# Altium project Interface Board V0.PrjPcb
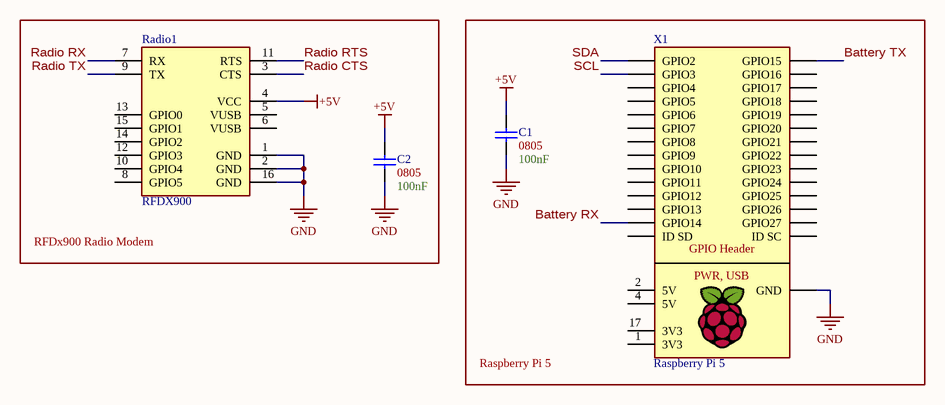
[diagram p0: Raspberry Pi and RF Devices.SchDoc]
5 sheets, 66 parts. Net scope: global (net labels, ports and power ports of the same name join across sheets).
Board file: main.PcbDoc
Sheets:
  Raspberry Pi and RF Devices.SchDoc
  Power.SchDoc
  CubePilot and Motor Drivers.SchDoc
  I2C Connections.SchDoc
  Misc.SchDoc

## Sheet Raspberry Pi and RF Devices.SchDoc
size B; SheetNumber: 1; SheetTotal: 5

### Parts
(Parts that share a designator on the sheet are numbered #1, #2 ... from top to bottom, then left to right.)
C1#1  Size Package: 0805  Capacitance: 100nF  [[Cap] SMD 0805]  (hidden comment: SMD Nonpolarized)
C2#1  Size Package: 0805  Capacitance: 100nF  [[Cap] SMD 0805]  (hidden comment: SMD Nonpolarized)
Radio1  RFDX900  [[Device] RFDX900 Radio]
X1  Raspberry Pi 5  [[Device] Raspberry Pi 5]

### Blocks framed on the sheet
RFDx900 Radio Modem: C2#1 Radio1
Raspberry Pi 5: C1#1 X1

### Nets
+5V: C1#1.1 C2#1.1 Radio1.4(VCC)
GND: C1#1.2 C2#1.2 Radio1.1(GND) Radio1.2(GND) Radio1.16(GND) X1.GND
Battery RX: X1.8(GPIO14)
Battery TX: X1.10(GPIO15)
Radio CTS: Radio1.3(CTS)
Radio RTS: Radio1.11(RTS)
Radio RX: Radio1.7(RX)
Radio TX: Radio1.9(TX)
SCL: X1.5(GPIO3)
SDA: X1.3(GPIO2)

Not connected (* = marked no-connect by the designer): Radio1 5(VUSB) 6(VUSB) 8(GPIO5) 10(GPIO4) 12(GPIO3) 13(GPIO0) 14(GPIO2) 15(GPIO1); X1 1(3V3) 2(5V) 4(5V) 7(GPIO4) 11(GPIO17) 12(GPIO18) 13(GPIO27) 15(GPIO22) 16(GPIO23) 17(3V3) 18(GPIO24) 19(GPIO10) 21(GPIO9) 22(GPIO25) 23(GPIO11) 24(GPIO7) 26(GPIO8) 27(ID_SD) 28(ID_SC) 29(GPIO5) 31(GPIO6) 32(GPIO12) 33(GPIO13) 35(GPIO19) 36(GPIO16) 37(GPIO26) 38(GPIO20) 40(GPIO21)

### Notes on the sheet
- (in symbol [Device] Raspberry Pi 5) GPIO Header; PWR, USB

### Library data of the parts
C1#1 C2#1 = [Cap] SMD Nonpolarized
Radio1 = [Device] RFDX900 Radio: RFDX900 Long-Range RF Module
X1 = [Device] Raspberry Pi 5

## Sheet Power.SchDoc
size A; SheetNumber: 2; SheetTotal: 5
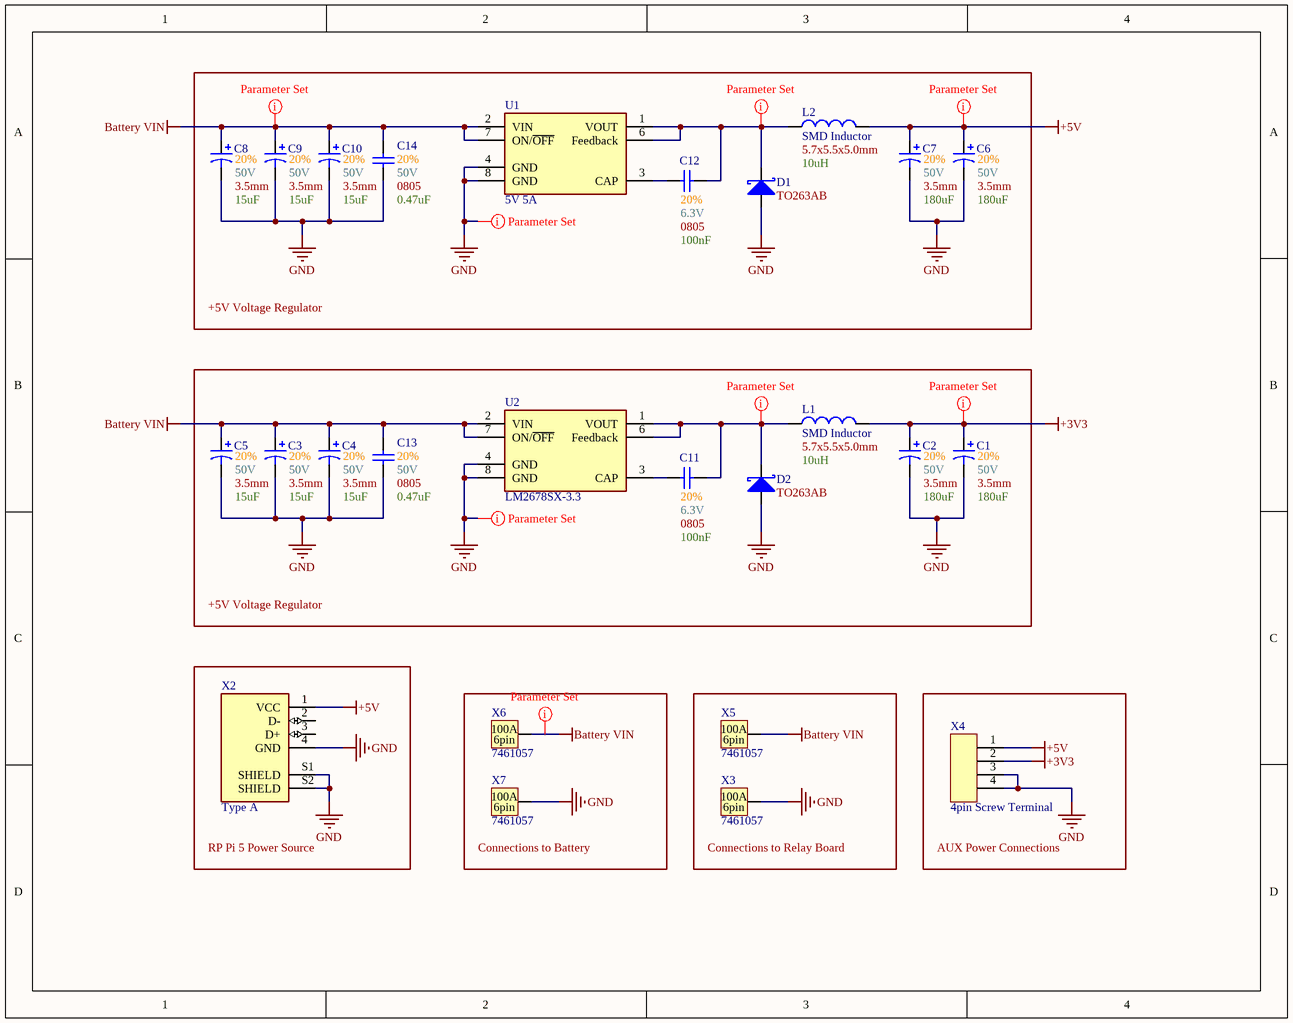
[diagram p1: Power.SchDoc]

### Parts
(Parts that share a designator on the sheet are numbered #1, #2 ... from top to bottom, then left to right.)
C1#2  Tolerance: 20%  Voltage: 50V  Pin Spacing: 3.5mm  Capacitance: 180uF  [[Cap] Thru-Hole Polarized 3.5mm]  (hidden comment: Thru-Hole Polarized)
C2#2  Tolerance: 20%  Voltage: 50V  Pin Spacing: 3.5mm  Capacitance: 180uF  [[Cap] Thru-Hole Polarized 3.5mm]  (hidden comment: Thru-Hole Polarized)
C3  Tolerance: 20%  Voltage: 50V  Pin Spacing: 3.5mm  Capacitance: 15uF  [[Cap] Thru-Hole Polarized 3.5mm]  (hidden comment: Thru-Hole Polarized)
C4  Tolerance: 20%  Voltage: 50V  Pin Spacing: 3.5mm  Capacitance: 15uF  [[Cap] Thru-Hole Polarized 3.5mm]  (hidden comment: Thru-Hole Polarized)
C5  Tolerance: 20%  Voltage: 50V  Pin Spacing: 3.5mm  Capacitance: 15uF  [[Cap] Thru-Hole Polarized 3.5mm]  (hidden comment: Thru-Hole Polarized)
C6  Tolerance: 20%  Voltage: 50V  Pin Spacing: 3.5mm  Capacitance: 180uF  [[Cap] Thru-Hole Polarized 3.5mm]  (hidden comment: Thru-Hole Polarized)
C7  Tolerance: 20%  Voltage: 50V  Pin Spacing: 3.5mm  Capacitance: 180uF  [[Cap] Thru-Hole Polarized 3.5mm]  (hidden comment: Thru-Hole Polarized)
C8  Tolerance: 20%  Voltage: 50V  Pin Spacing: 3.5mm  Capacitance: 15uF  [[Cap] Thru-Hole Polarized 3.5mm]  (hidden comment: Thru-Hole Polarized)
C9  Tolerance: 20%  Voltage: 50V  Pin Spacing: 3.5mm  Capacitance: 15uF  [[Cap] Thru-Hole Polarized 3.5mm]  (hidden comment: Thru-Hole Polarized)
C10  Tolerance: 20%  Voltage: 50V  Pin Spacing: 3.5mm  Capacitance: 15uF  [[Cap] Thru-Hole Polarized 3.5mm]  (hidden comment: Thru-Hole Polarized)
C11#1  Tolerance: 20%  Size Package: 0805  Capacitance: 100nF  Voltage: 6.3V  [[Cap] SMD 0805]  (hidden comment: SMD Nonpolarized)
C12#1  Tolerance: 20%  Size Package: 0805  Capacitance: 100nF  Voltage: 6.3V  [[Cap] SMD 0805]  (hidden comment: SMD Nonpolarized)
C13#1  Tolerance: 20%  Size Package: 0805  Capacitance: 0.47uF  Voltage: 50V  [[Cap] SMD 0805]  (hidden comment: SMD Nonpolarized)
C14#1  Tolerance: 20%  Size Package: 0805  Capacitance: 0.47uF  Voltage: 50V  [[Cap] SMD 0805]  (hidden comment: SMD Nonpolarized)
D1  Size Package: TO263AB  [[Diode] SMD TO263AB]  (hidden comment: Schottky)
D2  Size Package: TO263AB  [[Diode] SMD TO263AB]  (hidden comment: Schottky)
L1  SMD Inductor  Size Package: 5.7x5.5x5.0mm  Inductance: 10uH  [[Inductor] 5.7 x 5.5 x 5 mm]
L2  SMD Inductor  Size Package: 5.7x5.5x5.0mm  Inductance: 10uH  [[Inductor] 5.7 x 5.5 x 5 mm]
U1  5V 5A  [[Reg] 5V Regulator (3)]
U2  LM2678SX-3.3  [[Reg] 3V3 Regulator (3)]
X2  Type A  [[Port] USB Type-A Female]
X3  7461057  [[Port] Shank Connector (100A)]
X4  4pin Screw Terminal  [[Screw Terminal] 4pin 5mm]
X5  7461057  [[Port] Shank Connector (100A)]
X6#1  7461057  [[Port] Shank Connector (100A)]
X7#1  7461057  [[Port] Shank Connector (100A)]

### Blocks framed on the sheet
+5V Voltage Regulator: C6-C10 C12#1 C14#1 D1 L2 U1
+5V Voltage Regulator: C1#2 C2#2 C3-C5 C11#1 C13#1 D2 L1 U2
RP Pi 5 Power Source: X2
Connections to Battery: X6#1 X7#1
Connections to Relay Board: X3 X5
AUX Power Connections: X4

### Nets
+3V3: C1#2.1 C2#2.1 L1.2 X4.2
+5V: C6.1 C7.1 L2.2 X2.1(VCC) X4.1
Battery VIN: C3.1 C4.1 C5.1 C8.1 C9.1 C10.1 C13#1.2 C14#1.2 U1.2(VIN) U1.7(ON/~{OFF}) U2.2(VIN) U2.7(ON/~{OFF}) X5.1 X6#1.1
GND: C1#2.2 C2#2.2 C3.2 C4.2 C5.2 C6.2 C7.2 C8.2 C9.2 C10.2 C13#1.1 C14#1.1 D1.2(A) D2.2(A) U1.4(GND) U1.8(GND) U2.4(GND) U2.8(GND) X2.4(GND) X2.S1(SHIELD) X2.S2(SHIELD) X3.1 X4.3 X4.4 X7#1.1
NetC11#1_1: C11#1.1 U2.3(CAP)
NetC11#1_2: C11#1.2 D2.1(K) L1.1 U2.1(VOUT) U2.6(Feedback)
NetC12#1_1: C12#1.1 U1.3(CAP)
NetC12#1_2: C12#1.2 D1.1(K) L2.1 U1.1(VOUT) U1.6(Feedback)

Not connected (* = marked no-connect by the designer): X2 2(D-) 3(D+)

### Layout directives
net class Supply_Nets: +3V3, +5V, Battery VIN, GND, NetC11#1_2, NetC12#1_2
net class Motor VOUT: Battery VIN

### Notes on the sheet
- (in symbol [Port] Shank Connector (100A)) 100A; 6pin

### Library data of the parts
C1#2 C2#2 C6 C7 = [Cap] Thru-Hole Polarized
C3-C5 C8-C10 = [Cap] Thru-Hole Polarized: EEU-FC1H150H
C11#1 C12#1 C13#1 C14#1 = [Cap] SMD Nonpolarized
D1 D2 = [Diode] SMD Schottky: Generic
L1 L2 = [Inductor] SMD Inductor: JLC Part #: *; Mouser Part #: *
U1 = [Reg] 5V Regulator (3): LM2678SX-5.0/NOPB; Supplier 1: DigiKey; Supplier Part Number 1: LM2678SX-5.0/NOPBCT-ND
U2 = [Reg] 3V3 Regulator (3): LM2678SX-3.3/NOPB; Supplier 1: DigiKey; Supplier Part Number 1: LM2678SX-3.3/NOPBCT-ND
X2 = [Port] USB Type-A Female (Thru-Hole)
X3 X5 X6#1 X7#1 = [Port] Shank Connector (100A): 7461057, internal thread
X4 = [Screw Terminal] 4pin

## Sheet CubePilot and Motor Drivers.SchDoc
size A; SheetNumber: 3; SheetTotal: 5
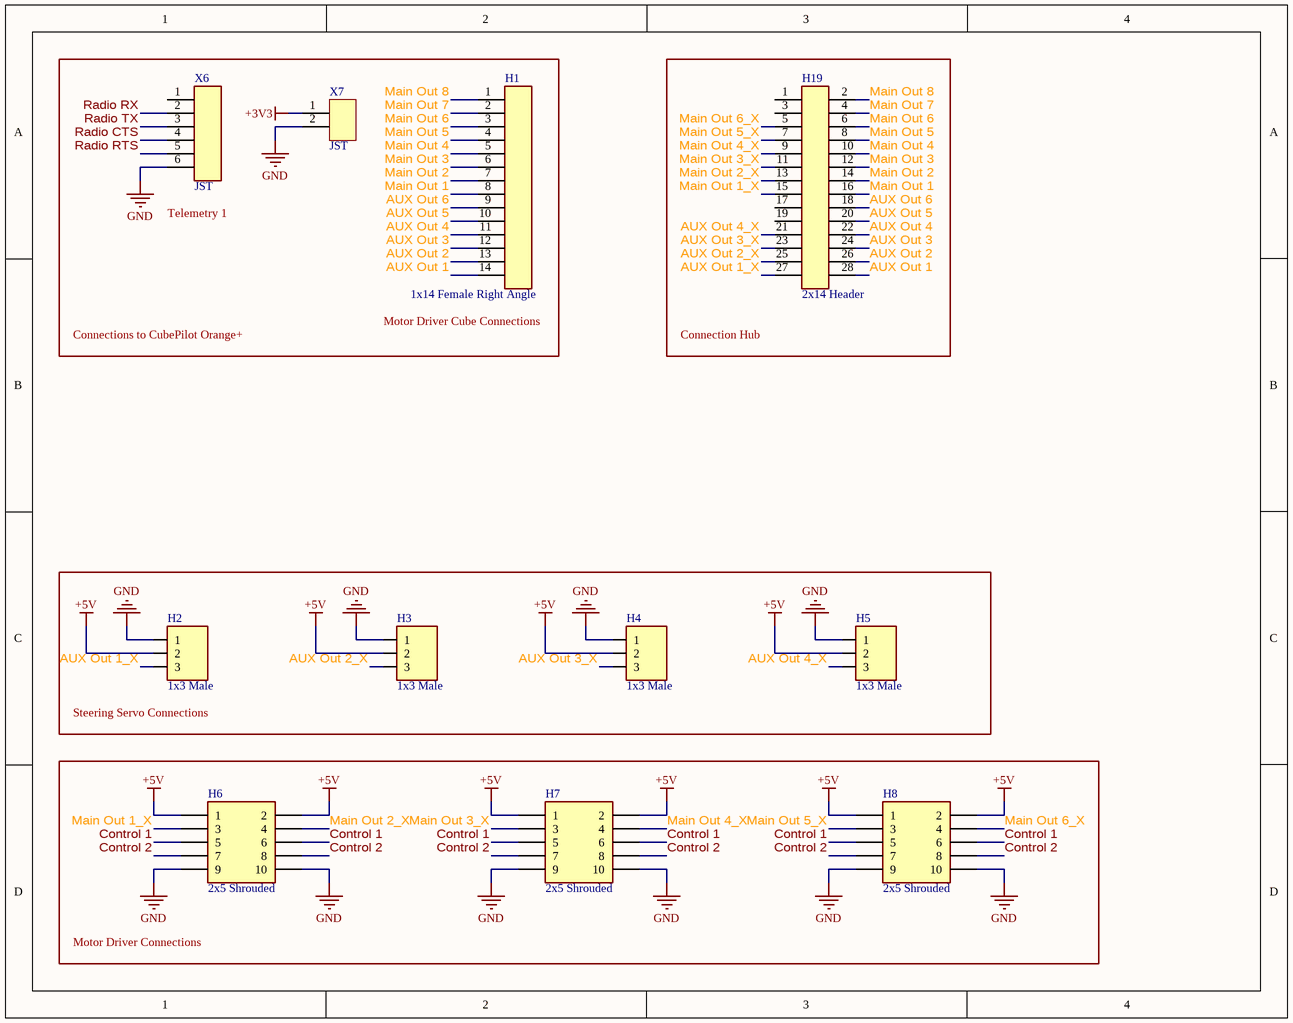
[diagram p2: CubePilot and Motor Drivers.SchDoc]

### Parts
(Parts that share a designator on the sheet are numbered #1, #2 ... from top to bottom, then left to right.)
H1  1x14 Female Right Angle  [[Header] 1x14 Right Angle Female]
H2  1x3 Male  [[Header] Shrouded 1x3 Male]
H3  1x3 Male  [[Header] Shrouded 1x3 Male]
H4  1x3 Male  [[Header] Shrouded 1x3 Male]
H5  1x3 Male  [[Header] Shrouded 1x3 Male]
H6  2x5 Shrouded  [[Header] Shrouded 2x5 Male]
H7  2x5 Shrouded  [[Header] Shrouded 2x5 Male]
H8  2x5 Shrouded  [[Header] Shrouded 2x5 Male]
H19  2x14 Header  [[Header] 2x14 Male]
X6#2  JST  [[JST] 6pin 2.54mm]
X7#2  JST  [[JST] 2PIN 2.54mm]

### Blocks framed on the sheet
Connection Hub: H19
Steering Servo Connections: H2-H5
Motor Driver Connections: H6-H8

### Nets
+3V3: X7#2.1
+5V: H2.2 H3.2 H4.2 H5.2 H6.1 H6.2 H7.1 H7.2 H8.1 H8.2
GND: H2.1 H3.1 H4.1 H5.1 H6.9 H6.10 H7.9 H7.10 H8.9 H8.10 X6#2.6 X7#2.2
AUX Out 1: H1.14 H19.28
AUX Out 1_X: H2.3 H19.27
AUX Out 2: H1.13 H19.26
AUX Out 2_X: H3.3 H19.25
AUX Out 3: H1.12 H19.24
AUX Out 3_X: H4.3 H19.23
AUX Out 4: H1.11 H19.22
AUX Out 4_X: H5.3 H19.21
AUX Out 5: H1.10 H19.20
AUX Out 6: H1.9 H19.18
Control 1: H6.5 H6.6 H7.5 H7.6 H8.5 H8.6
Control 2: H6.7 H6.8 H7.7 H7.8 H8.7 H8.8
Main Out 1: H1.8 H19.16
Main Out 1_X: H6.3 H19.15
Main Out 2: H1.7 H19.14
Main Out 2_X: H6.4 H19.13
Main Out 3: H1.6 H19.12
Main Out 3_X: H7.3 H19.11
Main Out 4: H1.5 H19.10
Main Out 4_X: H7.4 H19.9
Main Out 5: H1.4 H19.8
Main Out 5_X: H8.3 H19.7
Main Out 6: H1.3 H19.6
Main Out 6_X: H8.4 H19.5
Main Out 7: H1.2 H19.4
Main Out 8: H1.1 H19.2
Radio CTS: X6#2.4
Radio RTS: X6#2.5
Radio RX: X6#2.2
Radio TX: X6#2.3

Not connected (* = marked no-connect by the designer): H19 1 3 17 19; X6#2 1

### Notes on the sheet
- (near X6#2) Telemetry 1
- Connections to CubePilot Orange+
- (near H1) Motor Driver Cube Connections

### Library data of the parts
H1 = [Header] 1x14 Right Angle Female: 2.54mm pitch
H2-H5 = [Header] Shrouded 1x3 Male: 070543-0037 / Mates with 005057-9403; Supplier 1: DigiKey; Supplier Part Number 1: WM4825-ND
H6-H8 = [Header] Shrouded 2x5 Male: BHR-10-VUA
H19 = [Header] 2x14 Male: 2.54mm pitch
X6#2 = [JST] 6pin 2.54mm: 2.54mm pitch
X7#2 = [JST] 2pin 2.54mm: 2.54mm pitch

## Sheet I2C Connections.SchDoc
size B; SheetNumber: 4; SheetTotal: 5
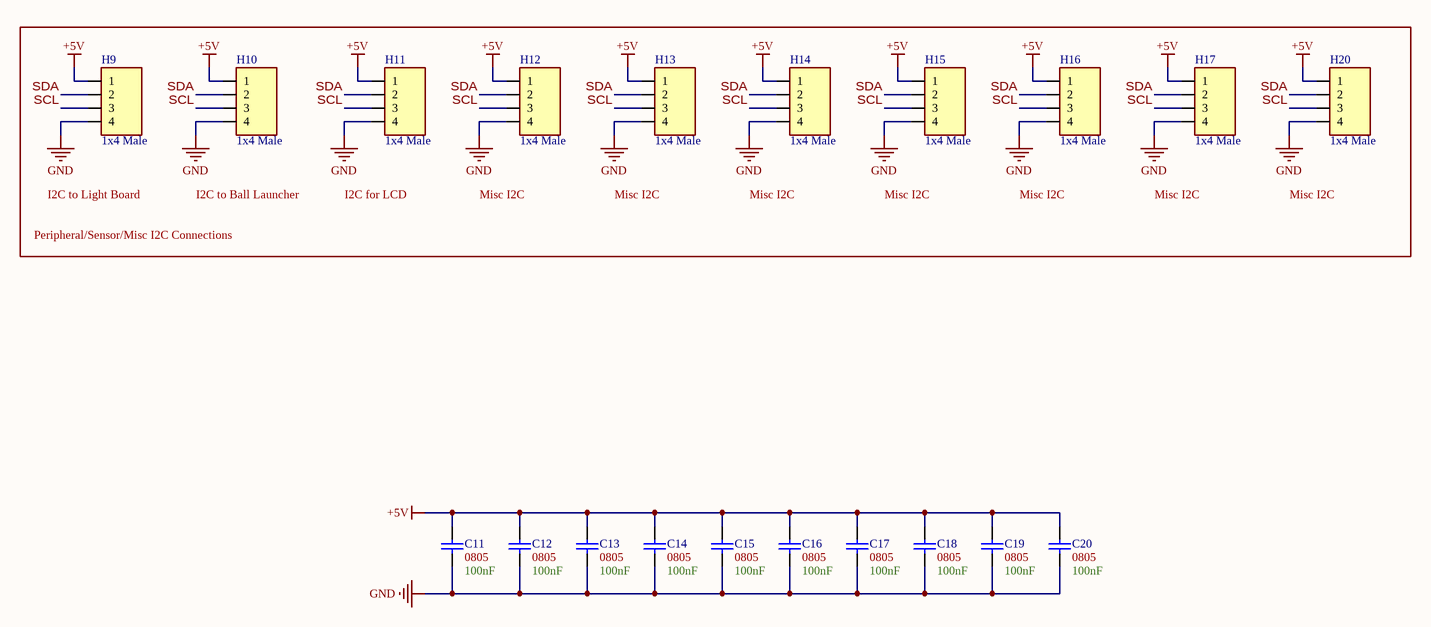
[diagram p3: I2C Connections.SchDoc]

### Parts
(Parts that share a designator on the sheet are numbered #1, #2 ... from top to bottom, then left to right.)
C11#2  Size Package: 0805  Capacitance: 100nF  [[Cap] SMD 0805]  (hidden comment: SMD Nonpolarized)
C12#2  Size Package: 0805  Capacitance: 100nF  [[Cap] SMD 0805]  (hidden comment: SMD Nonpolarized)
C13#2  Size Package: 0805  Capacitance: 100nF  [[Cap] SMD 0805]  (hidden comment: SMD Nonpolarized)
C14#2  Size Package: 0805  Capacitance: 100nF  [[Cap] SMD 0805]  (hidden comment: SMD Nonpolarized)
C15  Size Package: 0805  Capacitance: 100nF  [[Cap] SMD 0805]  (hidden comment: SMD Nonpolarized)
C16  Size Package: 0805  Capacitance: 100nF  [[Cap] SMD 0805]  (hidden comment: SMD Nonpolarized)
C17  Size Package: 0805  Capacitance: 100nF  [[Cap] SMD 0805]  (hidden comment: SMD Nonpolarized)
C18  Size Package: 0805  Capacitance: 100nF  [[Cap] SMD 0805]  (hidden comment: SMD Nonpolarized)
C19  Size Package: 0805  Capacitance: 100nF  [[Cap] SMD 0805]  (hidden comment: SMD Nonpolarized)
C20  Size Package: 0805  Capacitance: 100nF  [[Cap] SMD 0805]  (hidden comment: SMD Nonpolarized)
H9  1x4 Male  [[Header] Shrouded 1x4 Male]
H10  1x4 Male  [[Header] Shrouded 1x4 Male]
H11  1x4 Male  [[Header] Shrouded 1x4 Male]
H12  1x4 Male  [[Header] Shrouded 1x4 Male]
H13  1x4 Male  [[Header] Shrouded 1x4 Male]
H14  1x4 Male  [[Header] Shrouded 1x4 Male]
H15  1x4 Male  [[Header] Shrouded 1x4 Male]
H16  1x4 Male  [[Header] Shrouded 1x4 Male]
H17  1x4 Male  [[Header] Shrouded 1x4 Male]
H20  1x4 Male  [[Header] Shrouded 1x4 Male]

### Nets
+5V: C11#2.2 C12#2.2 C13#2.2 C14#2.2 C15.2 C16.2 C17.2 C18.2 C19.2 C20.2 H9.1 H10.1 H11.1 H12.1 H13.1 H14.1 H15.1 H16.1 H17.1 H20.1
GND: C11#2.1 C12#2.1 C13#2.1 C14#2.1 C15.1 C16.1 C17.1 C18.1 C19.1 C20.1 H9.4 H10.4 H11.4 H12.4 H13.4 H14.4 H15.4 H16.4 H17.4 H20.4
SCL: H9.3 H10.3 H11.3 H12.3 H13.3 H14.3 H15.3 H16.3 H17.3 H20.3
SDA: H9.2 H10.2 H11.2 H12.2 H13.2 H14.2 H15.2 H16.2 H17.2 H20.2

### Notes on the sheet
- I2C to Light Board
- I2C to Ball Launcher
- I2C for LCD
- Misc I2C
- Peripheral/Sensor/Misc I2C Connections

### Library data of the parts
C11#2 C12#2 C13#2 C14#2 C15-C20 = [Cap] SMD Nonpolarized
H9-H17 H20 = [Header] Shrouded 1x4 Male: 70543-0003 / Mates with 0050579404

## Sheet Misc.SchDoc
size A; SheetNumber: 5; SheetTotal: 5
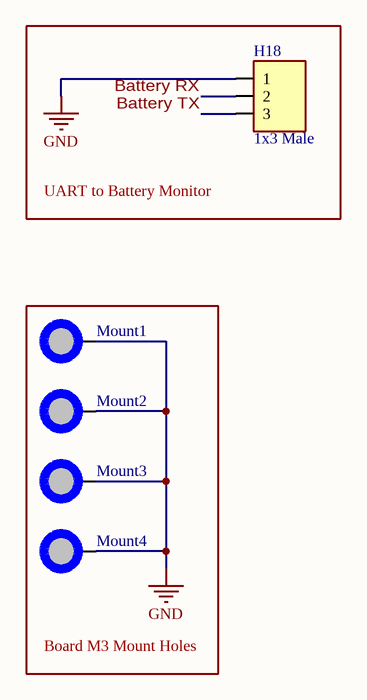
[diagram p4: Misc.SchDoc]

### Parts
H18  1x3 Male  [[Header] Shrouded 1x3 Male]
Mount1  M3 Mount Hole  [[Mount] M3 Mount Hole]  (value not drawn)  (no BOM)
Mount2  M3 Mount Hole  [[Mount] M3 Mount Hole]  (value not drawn)  (no BOM)
Mount3  M3 Mount Hole  [[Mount] M3 Mount Hole]  (value not drawn)  (no BOM)
Mount4  M3 Mount Hole  [[Mount] M3 Mount Hole]  (value not drawn)  (no BOM)

### Blocks framed on the sheet
UART to Battery Monitor: H18
Board M3 Mount Holes: Mount1-Mount4

### Nets
GND: H18.1 Mount1.1 Mount2.1 Mount3.1 Mount4.1
Battery RX: H18.2
Battery TX: H18.3

### Library data of the parts
H18 = [Header] Shrouded 1x3 Male: 070543-0037 / Mates with 005057-9403; Supplier 1: DigiKey; Supplier Part Number 1: WM4825-ND
Mount1-Mount4 = [Mount] M3 Mount Hole: Place at least 4.5mm from board edge. Plated.

## Nets that join several sheets
+3V3: Power (C1#2.1 C2#2.1 L1.2 X4.2), CubePilot and Motor Drivers (X7#2.1)
+5V: Raspberry Pi and RF Devices (C1#1.1 C2#1.1 Radio1.4), Power (5 pins), CubePilot and Motor Drivers (10 pins), I2C Connections (20 pins)
GND: Raspberry Pi and RF Devices (6 pins), Power (25 pins), CubePilot and Motor Drivers (12 pins), I2C Connections (20 pins), Misc (5 pins)
Battery RX: Raspberry Pi and RF Devices (X1.8), Misc (H18.2)
Battery TX: Raspberry Pi and RF Devices (X1.10), Misc (H18.3)
Radio CTS: Raspberry Pi and RF Devices (Radio1.3), CubePilot and Motor Drivers (X6#2.4)
Radio RTS: Raspberry Pi and RF Devices (Radio1.11), CubePilot and Motor Drivers (X6#2.5)
Radio RX: Raspberry Pi and RF Devices (Radio1.7), CubePilot and Motor Drivers (X6#2.2)
Radio TX: Raspberry Pi and RF Devices (Radio1.9), CubePilot and Motor Drivers (X6#2.3)
SCL: Raspberry Pi and RF Devices (X1.5), I2C Connections (10 pins)
SDA: Raspberry Pi and RF Devices (X1.3), I2C Connections (10 pins)